# EAGLE schematic PCC Robotics Keychain PCB (EAGLE 7.1.0)
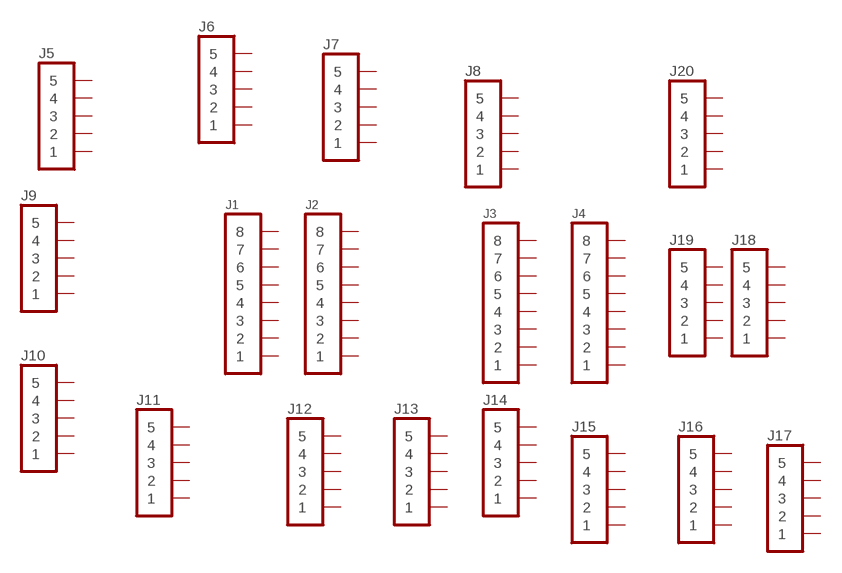
[diagram p0: schematic, sheet 1]

## Parts
J1  1X08NFNS  [1X08-NFNS]
J2  1X08NFNS  [1X08-NFNS]
J3  1X08NFNS  [1X08-NFNS]
J4  1X08NFNS  [1X08-NFNS]
J5  1X05NOSILK  [1X05-NOSILK]
J6  1X05NOSILK  [1X05-NOSILK]
J7  1X05NOSILK  [1X05-NOSILK]
J8  1X05NOSILK  [1X05-NOSILK]
J9  1X05NOSILK  [1X05-NOSILK]
J10  1X05NOSILK  [1X05-NOSILK]
J11  1X05NOSILK  [1X05-NOSILK]
J12  1X05NOSILK  [1X05-NOSILK]
J13  1X05NOSILK  [1X05-NOSILK]
J14  1X05NOSILK  [1X05-NOSILK]
J15  1X05NOSILK  [1X05-NOSILK]
J16  1X05NOSILK  [1X05-NOSILK]
J17  1X05NOSILK  [1X05-NOSILK]
J18  1X05NOSILK  [1X05-NOSILK]
J19  1X05NOSILK  [1X05-NOSILK]
J20  1X05NOSILK  [1X05-NOSILK]
Unconnected: J1.1 J1.2 J1.3 J1.4 J1.5 J1.6 J1.7 J1.8 J2.1 J2.2 J2.3 J2.4 J2.5 J2.6 J2.7 J2.8 J3.1 J3.2 J3.3 J3.4 J3.5 J3.6 J3.7 J3.8 J4.1 J4.2 J4.3 J4.4 J4.5 J4.6 J4.7 J4.8 J5.1 J5.2 J5.3 J5.4 J5.5 J6.1 J6.2 J6.3 J6.4 J6.5 J7.1 J7.2 J7.3 J7.4 J7.5 J8.1 J8.2 J8.3 J8.4 J8.5 J9.1 J9.2 J9.3 J9.4 J9.5 J10.1 J10.2 J10.3 J10.4 J10.5 J11.1 J11.2 J11.3 J11.4 J11.5 J12.1 J12.2 J12.3 J12.4 J12.5 J13.1 J13.2 J13.3 J13.4 J13.5 J14.1 J14.2 J14.3 J14.4 J14.5 J15.1 J15.2 J15.3 J15.4 J15.5 J16.1 J16.2 J16.3 J16.4 J16.5 J17.1 J17.2 J17.3 J17.4 J17.5 J18.1 J18.2 J18.3 J18.4 J18.5 J19.1 J19.2 J19.3 J19.4 J19.5 J20.1 J20.2 J20.3 J20.4 J20.5

## Library data of the parts
J1-J4 = Ai_Connectors:1X08
J5-J20 = Ai_Connectors:1X05